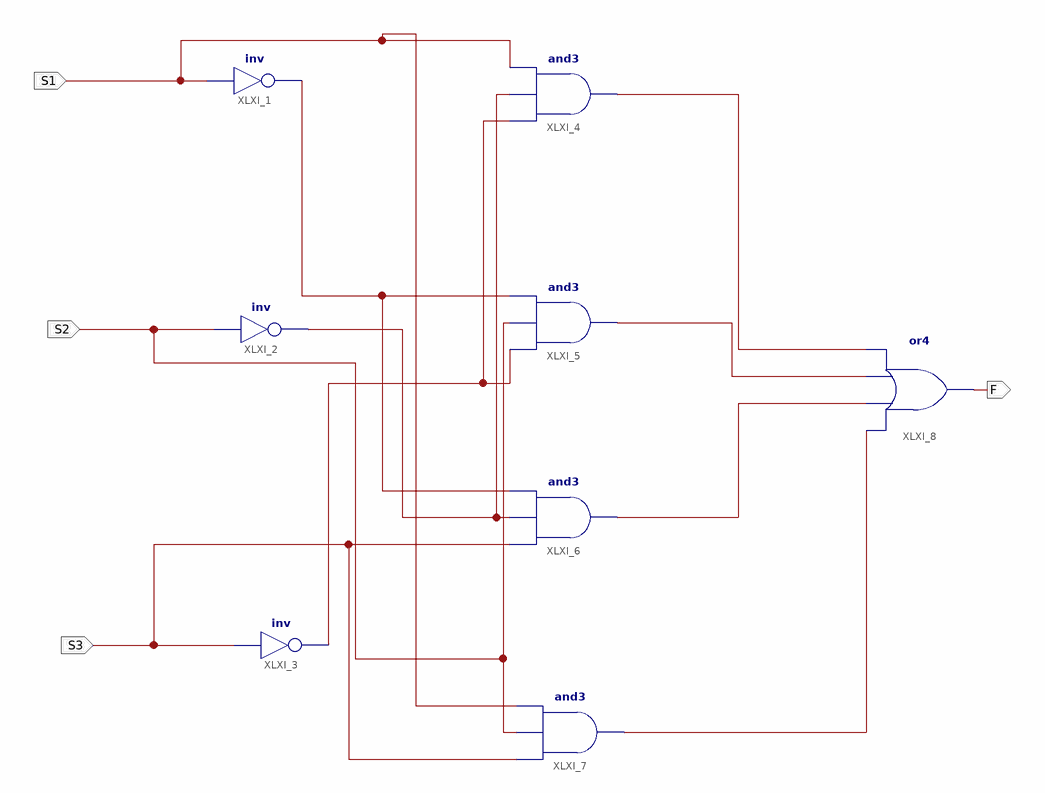
[diagram p0: schematic sheet 1]
// Xilinx ISE schematic LampCtrl.sch (kintex7) as structural Verilog: 8 symbols, 4 ports
module LampCtrl (
  input  S1,
  input  S3,
  input  S2,
  output F
);

  wire XLXN_4, XLXN_6, XLXN_9, XLXN_10, XLXN_11, XLXN_12, XLXN_17;

  not XLXI_1 (XLXN_6, S1);
  not XLXI_2 (XLXN_17, S2);
  not XLXI_3 (XLXN_4, S3);
  and XLXI_4 (XLXN_9, XLXN_4, XLXN_17, S1);
  and XLXI_5 (XLXN_10, XLXN_4, S2, XLXN_6);
  and XLXI_6 (XLXN_11, S3, XLXN_17, XLXN_6);
  and XLXI_7 (XLXN_12, S3, S2, S1);
  or XLXI_8 (F, XLXN_12, XLXN_11, XLXN_10, XLXN_9);
endmodule
